# Altium schematic sheet SwitchBlock.SchDoc: Relay Tester
size A4 portrait; Date: 2018.12.12; Author: Ivan Perehiniak; Address2: Ivan Perehiniak; Address3: iv.perehinik@gmail.com; Revision: 3; SheetNumber: 5; SheetTotal: 6
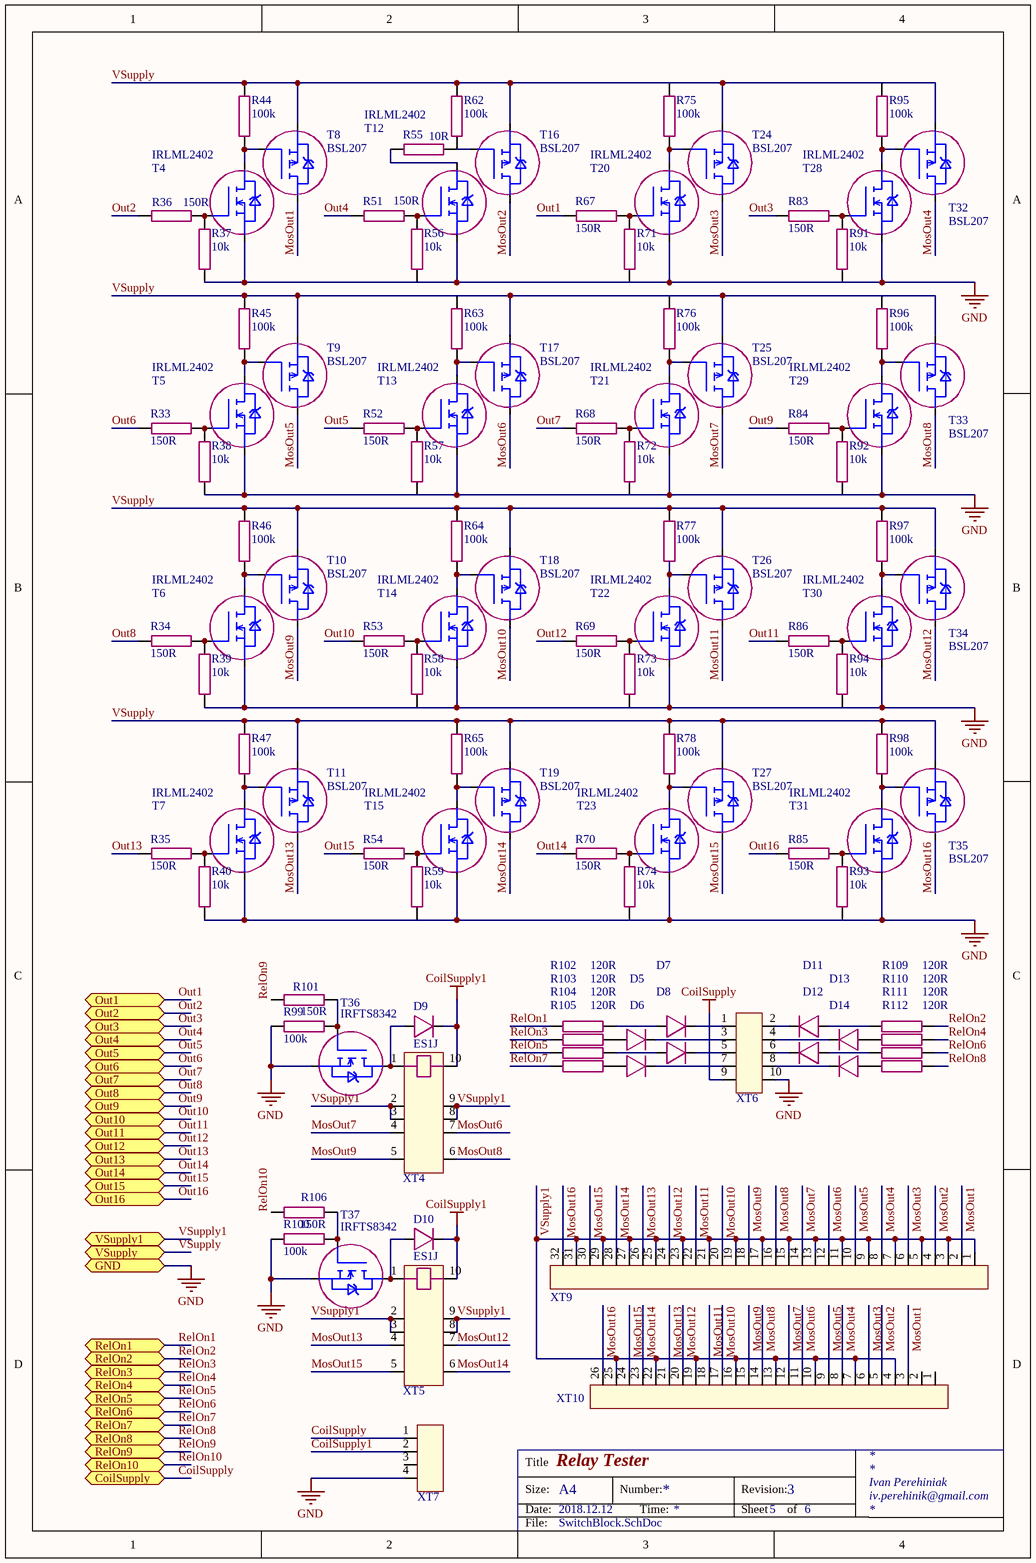
[diagram p0: SwitchBlock.SchDoc]

## Parts
D5  1N4148W  [SOD323]  (value not drawn)
D6  1N4148W  [SOD323]  (value not drawn)
D7  1N4148W  [SOD323]  (value not drawn)
D8  1N4148W  [SOD323]  (value not drawn)
D9  ES1J  [SMA]
D10  ES1J  [SMA]
D11  1N4148W  [SOD323]  (value not drawn)
D12  1N4148W  [SOD323]  (value not drawn)
D13  1N4148W  [SOD323]  (value not drawn)
D14  1N4148W  [SOD323]  (value not drawn)
R33  150R  [R0603]
R34  150R  [R0603]
R35  150R  [R0603]
R36  150R  [R0603]
R37  10k  [R0603]
R38  10k  [R0603]
R39  10k  [R0603]
R40  10k  [R0603]
R44  100k  [R0603]
R45  100k  [R0603]
R46  100k  [R0603]
R47  100k  [R0603]
R51  150R  [R0603]
R52  150R  [R0603]
R53  150R  [R0603]
R54  150R  [R0603]
R55  10R  [R1206]
R56  10k  [R0603]
R57  10k  [R0603]
R58  10k  [R0603]
R59  10k  [R0603]
R62  100k  [R0603]
R63  100k  [R0603]
R64  100k  [R0603]
R65  100k  [R0603]
R67  150R  [R0603]
R68  150R  [R0603]
R69  150R  [R0603]
R70  150R  [R0603]
R71  10k  [R0603]
R72  10k  [R0603]
R73  10k  [R0603]
R74  10k  [R0603]
R75  100k  [R0603]
R76  100k  [R0603]
R77  100k  [R0603]
R78  100k  [R0603]
R83  150R  [R0603]
R84  150R  [R0603]
R85  150R  [R0603]
R86  150R  [R0603]
R91  10k  [R0603]
R92  10k  [R0603]
R93  10k  [R0603]
R94  10k  [R0603]
R95  100k  [R0603]
R96  100k  [R0603]
R97  100k  [R0603]
R98  100k  [R0603]
R99  100k  [R0603]
R100  100k  [R0603]
R101  150R  [R0603]
R102  120R  [R0603]
R103  120R  [R0603]
R104  120R  [R0603]
R105  120R  [R0603]
R106  150R  [R0603]
R109  120R  [R0603]
R110  120R  [R0603]
R111  120R  [R0603]
R112  120R  [R0603]
T4  IRLML2402  [SOT-23]
T5  IRLML2402  [SOT-23]
T6  IRLML2402  [SOT-23]
T7  IRLML2402  [SOT-23]
T8  BSL207  [SOT23-6 - mosfet]
T9  BSL207  [SOT23-6 - mosfet]
T10  BSL207  [SOT23-6 - mosfet]
T11  BSL207  [SOT23-6 - mosfet]
T12  IRLML2402  [SOT-23]
T13  IRLML2402  [SOT-23]
T14  IRLML2402  [SOT-23]
T15  IRLML2402  [SOT-23]
T16  BSL207  [SOT23-6 - mosfet]
T17  BSL207  [SOT23-6 - mosfet]
T18  BSL207  [SOT23-6 - mosfet]
T19  BSL207  [SOT23-6 - mosfet]
T20  IRLML2402  [SOT-23]
T21  IRLML2402  [SOT-23]
T22  IRLML2402  [SOT-23]
T23  IRLML2402  [SOT-23]
T24  BSL207  [SOT23-6 - mosfet]
T25  BSL207  [SOT23-6 - mosfet]
T26  BSL207  [SOT23-6 - mosfet]
T27  BSL207  [SOT23-6 - mosfet]
T28  IRLML2402  [SOT-23]
T29  IRLML2402  [SOT-23]
T30  IRLML2402  [SOT-23]
T31  IRLML2402  [SOT-23]
T32  BSL207  [SOT23-6 - mosfet]
T33  BSL207  [SOT23-6 - mosfet]
T34  BSL207  [SOT23-6 - mosfet]
T35  BSL207  [SOT23-6 - mosfet]
T36  IRFTS8342  [SOT23-6 - mosfet]
T37  IRFTS8342  [SOT23-6 - mosfet]
XT4  RelSocket  [RelaySocket16Pin]  (value not drawn)
XT5  RelSocket  [RelaySocket16Pin]  (value not drawn)
XT6  IDC10  [PLD10-2]  (value not drawn)
XT7  PLS-4  [PLS-4]  (value not drawn)
XT9  PLS-32  [PLS-32female]  (value not drawn)
XT10  PLS-26  [PLS-26female]  (value not drawn)

## Ports
CoilSupply, GND, Out1, Out2, Out3, Out4, Out5, Out6, Out7, Out8, Out9, Out10, Out11, Out12, Out13, Out14, Out15, Out16, RelOn1, RelOn2, RelOn3, RelOn4, RelOn5, RelOn6, RelOn7, RelOn8, RelOn9, RelOn10, VSupply, VSupply1

## Nets
CoilSupply: XT6.9 XT7.1 ; port CoilSupply
CoilSupply1: D9.2(Cathode) D10.2(Cathode) XT4.10 XT5.10 XT7.2
GND: R37.1 R38.1 R39.1 R40.1 R56.1 R57.1 R58.1 R59.1 R71.1 R72.1 R73.1 R74.1 R91.1 R92.1 R93.1 R94.1 R99.2 R100.2 T4.2(SOURSE) T5.2(SOURSE) T6.2(SOURSE) T7.2(SOURSE) T12.2(SOURSE) T13.2(SOURSE) T14.2(SOURSE) T15.2(SOURSE) T20.2(SOURSE) T21.2(SOURSE) T22.2(SOURSE) T23.2(SOURSE) T28.2(SOURSE) T29.2(SOURSE) T30.2(SOURSE) T31.2(SOURSE) T36.3(SOURSE) T37.3(SOURSE) XT6.10 XT7.4 ; port GND
MosOut1: T8.2(DRAIN) XT9.2 XT10.3
MosOut2: T16.2(DRAIN) XT9.4 XT10.5
MosOut3: T24.2(DRAIN) XT9.6 XT10.6
MosOut4: T32.2(DRAIN) XT9.8 XT10.8
MosOut5: T9.2(DRAIN) XT9.10 XT10.9
MosOut6: T17.2(DRAIN) XT4.7 XT9.12 XT10.11
MosOut7: T25.2(DRAIN) XT4.4 XT9.14 XT10.12
MosOut8: T33.2(DRAIN) XT4.6 XT9.16 XT10.14
MosOut9: T10.2(DRAIN) XT4.5 XT9.18 XT10.15
MosOut10: T18.2(DRAIN) XT9.20 XT10.17
MosOut11: T26.2(DRAIN) XT9.22 XT10.18
MosOut12: T34.2(DRAIN) XT5.7 XT9.24 XT10.20
MosOut13: T11.2(DRAIN) XT5.4 XT9.26 XT10.21
MosOut14: T19.2(DRAIN) XT5.6 XT9.28 XT10.23
MosOut15: T27.2(DRAIN) XT5.5 XT9.30 XT10.24
MosOut16: T35.2(DRAIN) XT9.32 XT10.26
Out1: R67.1 ; port Out1
Out2: R36.1 ; port Out2
Out3: R83.1 ; port Out3
Out4: R51.1 ; port Out4
Out5: R52.1 ; port Out5
Out6: R33.1 ; port Out6
Out7: R68.1 ; port Out7
Out8: R34.1 ; port Out8
Out9: R84.1 ; port Out9
Out10: R53.1 ; port Out10
Out11: R86.1 ; port Out11
Out12: R69.1 ; port Out12
Out13: R35.1 ; port Out13
Out14: R70.1 ; port Out14
Out15: R54.1 ; port Out15
Out16: R85.1 ; port Out16
RelOn1: R102.1 ; port RelOn1
RelOn2: R109.2 ; port RelOn2
RelOn3: R103.1 ; port RelOn3
RelOn4: R110.2 ; port RelOn4
RelOn5: R104.1 ; port RelOn5
RelOn6: R111.2 ; port RelOn6
RelOn7: R105.1 ; port RelOn7
RelOn8: R112.2 ; port RelOn8
RelOn9: R101.1 ; port RelOn9
RelOn10: R106.1 ; port RelOn10
VSupply: R44.2 R45.2 R46.2 R47.2 R62.2 R63.2 R64.2 R65.2 R75.2 R76.2 R77.2 R78.2 R95.2 R96.2 R97.2 R98.2 T8.3(SOURSE) T9.3(SOURSE) T10.3(SOURSE) T11.3(SOURSE) T16.3(SOURSE) T17.3(SOURSE) T18.3(SOURSE) T19.3(SOURSE) T24.3(SOURSE) T25.3(SOURSE) T26.3(SOURSE) T27.3(SOURSE) T32.3(SOURSE) T33.3(SOURSE) T34.3(SOURSE) T35.3(SOURSE) ; port VSupply
VSupply1: XT4.2 XT4.3 XT4.8 XT4.9 XT5.2 XT5.3 XT5.8 XT5.9 XT9.1 XT9.3 XT9.5 XT9.7 XT9.9 XT9.11 XT9.13 XT9.15 XT9.17 XT9.19 XT9.21 XT9.23 XT9.25 XT9.27 XT9.29 XT9.31 XT10.4 XT10.7 XT10.10 XT10.13 XT10.16 XT10.19 XT10.22 XT10.25 ; port VSupply1
NetD5_1: D5.1(Anode) R103.2
NetD5_2: D5.2(Cathode) XT6.3
NetD6_1: D6.1(Anode) R105.2
NetD6_2: D6.2(Cathode) XT6.7
NetD7_1: D7.1(Anode) R102.2
NetD7_2: D7.2(Cathode) XT6.1
NetD8_1: D8.1(Anode) R104.2
NetD8_2: D8.2(Cathode) XT6.5
NetD9_1: D9.1(Anode) T36.2(DRAIN) XT4.1
NetD10_1: D10.1(Anode) T37.2(DRAIN) XT5.1
NetD11_1: D11.1(Anode) R109.1
NetD11_2: D11.2(Cathode) XT6.2
NetD12_1: D12.1(Anode) R111.1
NetD12_2: D12.2(Cathode) XT6.6
NetD13_1: D13.1(Anode) R110.1
NetD13_2: D13.2(Cathode) XT6.4
NetD14_1: D14.1(Anode) R112.1
NetD14_2: D14.2(Cathode) XT6.8
NetR33_2: R33.2 R38.2 T5.1(GATE)
NetR34_2: R34.2 R39.2 T6.1(GATE)
NetR35_2: R35.2 R40.2 T7.1(GATE)
NetR36_2: R36.2 R37.2 T4.1(GATE)
NetR44_1: R44.1 T4.3(DRAIN) T8.1(GATE)
NetR45_1: R45.1 T5.3(DRAIN) T9.1(GATE)
NetR46_1: R46.1 T6.3(DRAIN) T10.1(GATE)
NetR47_1: R47.1 T7.3(DRAIN) T11.1(GATE)
NetR51_2: R51.2 R56.2 T12.1(GATE)
NetR52_2: R52.2 R57.2 T13.1(GATE)
NetR53_2: R53.2 R58.2 T14.1(GATE)
NetR54_2: R54.2 R59.2 T15.1(GATE)
NetR55_1: R55.1 T12.3(DRAIN)
NetR55_2: R55.2 R62.1 T16.1(GATE)
NetR63_1: R63.1 T13.3(DRAIN) T17.1(GATE)
NetR64_1: R64.1 T14.3(DRAIN) T18.1(GATE)
NetR65_1: R65.1 T15.3(DRAIN) T19.1(GATE)
NetR67_2: R67.2 R71.2 T20.1(GATE)
NetR68_2: R68.2 R72.2 T21.1(GATE)
NetR69_2: R69.2 R73.2 T22.1(GATE)
NetR70_2: R70.2 R74.2 T23.1(GATE)
NetR75_1: R75.1 T20.3(DRAIN) T24.1(GATE)
NetR76_1: R76.1 T21.3(DRAIN) T25.1(GATE)
NetR77_1: R77.1 T22.3(DRAIN) T26.1(GATE)
NetR78_1: R78.1 T23.3(DRAIN) T27.1(GATE)
NetR83_2: R83.2 R91.2 T28.1(GATE)
NetR84_2: R84.2 R92.2 T29.1(GATE)
NetR85_2: R85.2 R93.2 T31.1(GATE)
NetR86_2: R86.2 R94.2 T30.1(GATE)
NetR95_1: R95.1 T28.3(DRAIN) T32.1(GATE)
NetR96_1: R96.1 T29.3(DRAIN) T33.1(GATE)
NetR97_1: R97.1 T30.3(DRAIN) T34.1(GATE)
NetR98_1: R98.1 T31.3(DRAIN) T35.1(GATE)
NetR99_1: R99.1 R101.2 T36.1(GATE)
NetR100_1: R100.1 R106.2 T37.1(GATE)

Not connected (* = marked no-connect by the designer): XT7 3; XT10 1 2

## Notes on the sheet
- Title
- Size:
- Date:
- A4
- Number:
- Time:
- Revision:
- Sheet
- of
- File:

## Library data of the parts
D5-D8 D11-D14 = 1N4148WX-TP: DIODE GEN PURP 75V 150MA SOD323; Category: Discrete Semiconductor Products; Manufacturer Part Number: 1N4148WX-TP; Package / Case: SC-76, SOD-323; Base Part Number: 1N4148WX
D9 D10 = ES1J-LTP: DIODE GEN PURP 600V 1A DO214AC; Category: Discrete Semiconductor Products; Manufacturer Part Number: ES1J-LTP; Package / Case: DO-214AC, SMA
R33-R36 R51-R54 R67-R70 R83-R86 R101 R106 = RC0603JR-07150RL: RES SMD 150 OHM 5% 1/10W 0603; Category: Resistors; Manufacturer Part Number: RC0603JR-07150RL; Package / Case: 0603 (1608 Metric)
R37-R40 R56-R59 R71-R74 R91-R94 = ERJ-S03J103V: RES SMD 10K OHM 5% 1/10W 0603; Category: Resistors; Package / Case: 0603 (1608 Metric); Manufacturer Part Number: ERJ-S03J103V; ComponentLink1URL: https://industrial.panasonic.com/cdbs/www-data/pdf/RDA0000/AOA0000C304.pdf; ComponentLink1Description: https://industrial.panasonic.com/cdbs/www-data/pdf/RDA0000/AOA0000C304.pdf; ComponentLink2URL: http://industrial.panasonic.com/www-cgi/jvcr13pz.cgi?E+PZ+3+AOA0005+ERJS03J101V+7+WW; ComponentLink2Description: http://industrial.panasonic.com/www-cgi/jvcr13pz.cgi?E+PZ+3+AOA0005+ERJS03J101V+7+WW; ComponentLink3URL: https://industrial.panasonic.com/cdbs/www-data/pdf/RDO0000/AOA0000C331.pdf; ComponentLink3Description: https://industrial.panasonic.com/cdbs/www-data/pdf/RDO0000/AOA0000C331.pdf
R44-R47 R62-R65 R75-R78 R95-R100 = ERJ-S03J104V: RES SMD 100K OHM 5% 1/10W 0603; Category: Resistors; Package / Case: 0603 (1608 Metric); Manufacturer Part Number: ERJ-S03J104V; ComponentLink1URL: https://industrial.panasonic.com/cdbs/www-data/pdf/RDA0000/AOA0000C304.pdf; ComponentLink1Description: https://industrial.panasonic.com/cdbs/www-data/pdf/RDA0000/AOA0000C304.pdf; ComponentLink2URL: http://industrial.panasonic.com/www-cgi/jvcr13pz.cgi?E+PZ+3+AOA0005+ERJS03J101V+7+WW; ComponentLink2Description: http://industrial.panasonic.com/www-cgi/jvcr13pz.cgi?E+PZ+3+AOA0005+ERJS03J101V+7+WW; ComponentLink3URL: https://industrial.panasonic.com/cdbs/www-data/pdf/RDO0000/AOA0000C331.pdf; ComponentLink3Description: https://industrial.panasonic.com/cdbs/www-data/pdf/RDO0000/AOA0000C331.pdf
R55 = ERJ-8GEYJ100V: RES SMD 10 OHM 5% 1/4W 1206; Category: Resistors; Package / Case: 1206 (3216 Metric); Manufacturer Part Number: ERJ-8GEYJ100V; ComponentLink1URL: https://industrial.panasonic.com/cdbs/www-data/pdf/RDA0000/AOA0000C304.pdf; ComponentLink1Description: https://industrial.panasonic.com/cdbs/www-data/pdf/RDA0000/AOA0000C304.pdf; ComponentLink2URL: http://industrial.panasonic.com/www-cgi/jvcr13pz.cgi?E+PZ+3+AOA0005+ERJS03J101V+7+WW; ComponentLink2Description: http://industrial.panasonic.com/www-cgi/jvcr13pz.cgi?E+PZ+3+AOA0005+ERJS03J101V+7+WW
R102-R105 R109-R112 = ERJ-3GEYJ121V: RES SMD 120 OHM 5% 1/10W 0603; Category: Resistors; Package / Case: 0603 (1608 Metric); Manufacturer Part Number: ERJ-3GEYJ121V; ComponentLink3URL: https://industrial.panasonic.com/cdbs/www-data/pdf/RDO0000/AOA0000C331.pdf; ComponentLink3Description: https://industrial.panasonic.com/cdbs/www-data/pdf/RDO0000/AOA0000C331.pdf
T4-T7 T12-T15 T20-T23 T28-T31 = IRLML2402TRPBF: MOSFET N-CH 20V 1.2A SOT-23; Category: Discrete Semiconductor Products; Manufacturer Part Number: IRLML2402TRPBF; Package / Case: TO-236-3, SC-59, SOT-23-3
T8-T11 T16-T19 T24-T27 T32-T35 = BSL207SPH6327XTSA1: MOSFET P-CH 20V 6A 6TSOP; Category: Discrete Semiconductor Products; Manufacturer Part Number: BSL207SPH6327XTSA1; Package / Case: SOT-23-6 Thin, TSOT-23-6
T36 T37 = IRFTS8342: MOSFET N-CH 30V 8.2A 6TSOP; Manufacturer Part Number: IRFTS8342TRPBF; Category: Discrete Semiconductor Products; Package / Case: SOT-23-6
XT4 XT5 = RelSocket: REL SOCKET UNI 7.62x2.54 PITCH
XT6 = IDC10: DIL VERTICAL PC TAIL PIN HEADER; Manufacturer Part Number: 67997-410HLF; Category: Connectors, Interconnects
XT7 = PLS-4: CONN HEADER 4POS .100 STR TIN; Manufacturer Part Number: 68000-404HLF; Category: Connectors, Interconnects
XT9 = PLS-32: SIL VERTICAL PC TAIL PIN HEADER; Manufacturer Part Number: M20-9990346; Category: Connectors, Interconnects
XT10 = PLS-26: SIL VERTICAL PC TAIL PIN HEADER; Manufacturer Part Number: M20-9990346; Category: Connectors, Interconnects